# Altium schematic sheet Jetson Nano Connector.SchDoc
size A; SheetNumber: 4; SheetTotal: 12
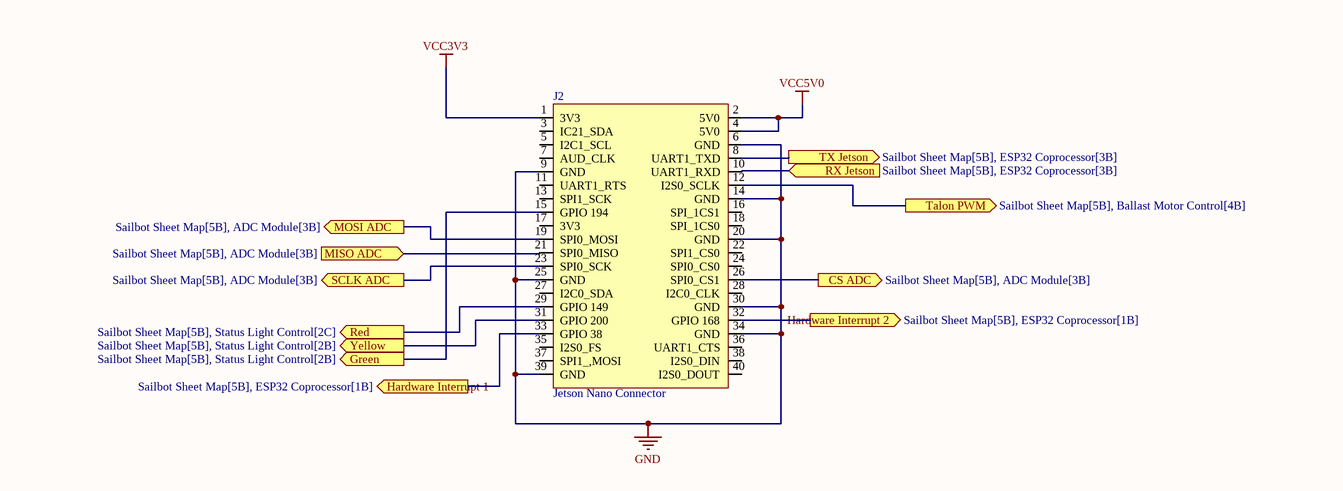
[diagram p0: Jetson Nano Connector.SchDoc]

## Parts
J2  Jetson Nano Connector  [Jetson Nano Header]

## Ports
CS ADC (out, see Sailbot Sheet Map[5B], ADC Module[3B]), Green (out, see Sailbot Sheet Map[5B], Status Light Control[2B]), Hardware Interrupt 1 (out, see Sailbot Sheet Map[5B], ESP32 Coprocessor[1B]), Hardware Interrupt 2 (out, see Sailbot Sheet Map[5B], ESP32 Coprocessor[1B]), MISO ADC (in, see Sailbot Sheet Map[5B], ADC Module[3B]), MOSI ADC (out, see Sailbot Sheet Map[5B], ADC Module[3B]), Red (out, see Sailbot Sheet Map[5B], Status Light Control[2C]), RX Jetson (in, see Sailbot Sheet Map[5B], ESP32 Coprocessor[3B]), SCLK ADC (out, see Sailbot Sheet Map[5B], ADC Module[3B]), Talon PWM (out, see Sailbot Sheet Map[5B], Ballast Motor Control[4B]), TX Jetson (out, see Sailbot Sheet Map[5B], ESP32 Coprocessor[3B]), Yellow (out, see Sailbot Sheet Map[5B], Status Light Control[2B])

## Nets
GND: J2.6(GND) J2.9(GND) J2.14(GND) J2.20(GND) J2.25(GND) J2.30(GND) J2.34(GND) J2.39(GND)
VCC3V3: J2.1(3V3)
VCC5V0: J2.2(5V0) J2.4(5V0)
CS ADC: J2.26(SPI0_CS1) ; port CS ADC
Green: J2.15(GPIO_194) ; port Green
Hardware Interrupt 1: J2.33(GPIO_38) ; port Hardware Interrupt 1
Hardware Interrupt 2: J2.32(GPIO_168) ; port Hardware Interrupt 2
MISO ADC: J2.21(SPI0_MISO) ; port MISO ADC
MOSI ADC: J2.19(SPI0_MOSI) ; port MOSI ADC
Red: J2.29(GPIO_149) ; port Red
RX Jetson: J2.10(UART1_RXD) ; port RX Jetson
SCLK ADC: J2.23(SPI0_SCK) ; port SCLK ADC
Talon PWM: J2.12(I2S0_SCLK) ; port Talon PWM
TX Jetson: J2.8(UART1_TXD) ; port TX Jetson
Yellow: J2.31(GPIO_200) ; port Yellow

Not connected (* = marked no-connect by the designer): J2 3(IC21_SDA) 5(I2C1_SCL) 7(AUD_CLK) 11(UART1_RTS) 13(SPI1_SCK) 16(SPI_1CS1) 17(3V3) 18(SPI_1CS0) 22(SPI1_CS0) 24(SPI0_CS0) 27(I2C0_SDA) 28(I2C0_CLK) 35(I2S0_FS) 36(UART1_CTS) 37(SPI1_,MOSI) 38(I2S0_DIN) 40(I2S0_DOUT)